# Altium schematic sheet USB_HUB.SchDoc: MISKO 3.0
size A4; Date: 19.9.2021; Author: AMADEJ PAPEŽ; SheetNumber: 4; SheetTotal: 13; SheetTitle: USB_HUB; Version: V1.1
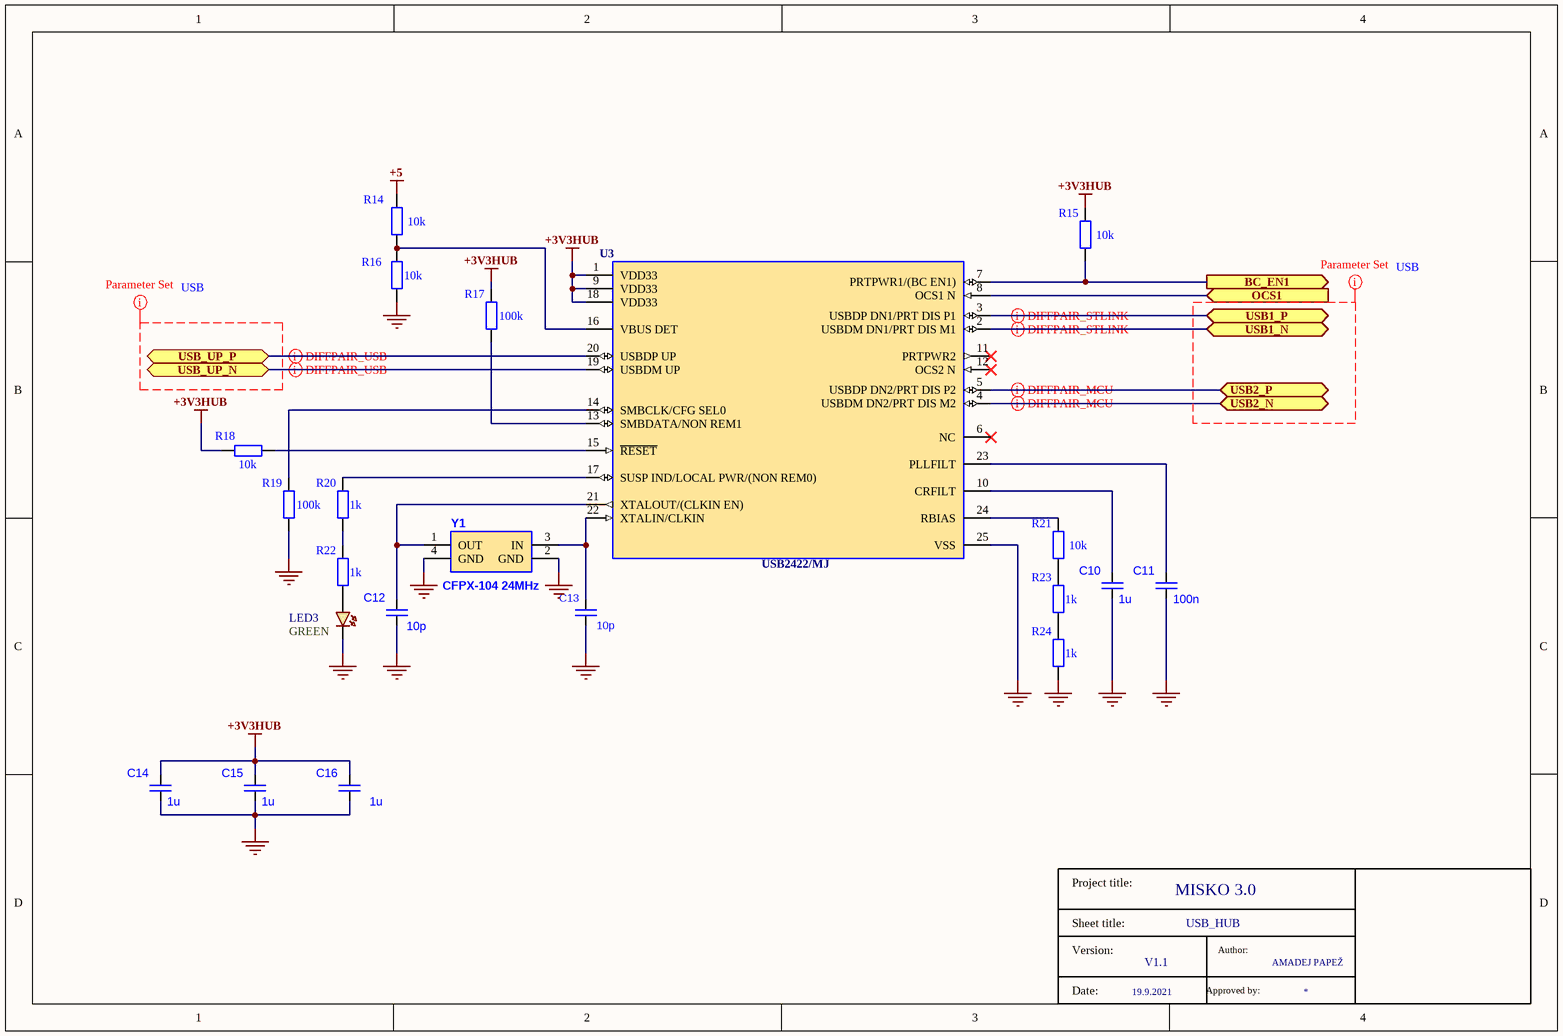
[diagram p0: USB_HUB.SchDoc]

## Parts
C10  value 1u  [C0603]
C11  value 100n  [C0603]
C12  value 10p  [C0603]
C13  value 10p  [C0603]
C14  value 1u  [C0603]
C15  value 1u  [C0603]
C16  value 1u  [C0603]
LED3  GREEN  [LED0603]
R14  value 10k  [R1608_0603I_L]
R15  value 10k  [R1608_0603I_L]
R16  value 10k  [R1608_0603I_L]
R17  value 100k  [R1608_0603I_L]
R18  value 10k  [R1608_0603I_L]
R19  value 100k  [R1608_0603I_L]
R20  value 1k  [R1608_0603I_L]
R21  value 10k  [R1608_0603I_L]
R22  value 1k  [R1608_0603I_L]
R23  value 1k  [R1608_0603I_L]
R24  value 1k  [R1608_0603I_L]
T4  (no value)
U3  USB2422/MJ  [FP-24-S4QFN-4x4B-0_5P-IPC_C]
Y1  CFPX-104 24MHz  [ABM3B24MHZB2T]

## Ports
BC_EN1 (out), OCS1 (in), USB1_N (bidir), USB1_P (bidir), USB2_N (bidir), USB2_P (bidir), USB_UP_N (bidir), USB_UP_P (bidir)

## Nets
+3V3HUB: C14.2 C15.2 C16.2 R15.2 R17.1 R18.2 U3.1(VDD33) U3.9(VDD33) U3.18(VDD33)
+5: R14.2
GND: C10.2 C11.2 C12.1 C13.1 C14.1 C15.1 C16.1 LED3.1(KATODE) R16.1 R19.1 R24.1 U3.25(VSS) Y1.2(GND) Y1.4(GND)
BC_EN1: R15.1 U3.7(PRTPWR1/(BC_EN1)) ; port BC_EN1
OCS1: U3.8(OCS1_N) ; port OCS1
USB1_N: U3.2(USBDM_DN1/PRT_DIS_M1) ; port USB1_N
USB1_P: U3.3(USBDP_DN1/PRT_DIS_P1) ; port USB1_P
USB2_N: U3.4(USBDM_DN2/PRT_DIS_M2) ; port USB2_N
USB2_P: U3.5(USBDP_DN2/PRT_DIS_P2) ; port USB2_P
USB_UP_N: U3.19(USBDM_UP) ; port USB_UP_N
USB_UP_P: U3.20(USBDP_UP) ; port USB_UP_P
NetC10_1: C10.1 U3.10(CRFILT)
NetC11_1: C11.1 U3.23(PLLFILT)
NetC12_2: C12.2 U3.21(XTALOUT/(CLKIN_EN)) Y1.1(OUT)
NetC13_2: C13.2 U3.22(XTALIN/CLKIN) Y1.3(IN)
NetLED3_2: LED3.2(ANODE) R22.2
NetR14_1: R14.1 R16.2 U3.16(VBUS_DET)
NetR17_2: R17.2 U3.13(SMBDATA/NON_REM1)
NetR18_1: R18.1 U3.15(~{RESET})
NetR19_2: R19.2 U3.14(SMBCLK/CFG_SEL0)
NetR20_1: R20.1 U3.17(SUSP_IND/LOCAL_PWR/(NON_REM0))
NetR20_2: R20.2 R22.1
NetR21_1: R21.1 U3.24(RBIAS)
NetR21_2: R21.2 R23.2
NetR23_1: R23.1 R24.2

Not connected (* = marked no-connect by the designer): U3 6(NC)* 11(PRTPWR2)* 12(OCS2_N)*

## Layout directives
differential pair: USB1_N, USB1_P, USB2_N, USB2_P, USB_UP_N, USB_UP_P
net class USB: (no net found under the mark)

## Notes on the sheet
- (in symbol Title block) Project title:; Sheet title:; Version:; Author:; Date:; Approved by:

## Library data of the parts
C10 C14-C16 = C: Capacitor; Code: NB7-1U-25V
C11 = C: Capacitor; Code: NB6-100N
C12 C13 = C: Capacitor; Code: NB2-10P
LED3 = LED: Green light-emitting diode; Code: KLC-G
R14-R16 R18 R21 = R: Code: LC5-10K
R17 R19 = R: Code: LC6-100K
R20 R22-R24 = R: Code: LC4-1K
T4 = Title block
U3 = USB2422/MJ: IC HUB CTLR USB 2.0 24QFN / DataSheet: / http://ww1.microchip.com/downloads/en/devicedoc/00001726b.pdf; Operating Supply Voltage: 3.3V; Data Rate: 480Mbps; Number of Ports: 2; Interface: I2C; Operating Supply Current: 70mA; Code: FC-USB2422MJ; Case/Package: QFN; Packaging: Bulk; Package Quantity: 490; Lead Free: Lead Free; Min Operating Temperature: 0°C; Number of Pins: 24; RoHS Compliant: Yes; Max Operating Temperature: 70°C
Y1 = ABM3B-24MHZ-B-2-T: ComponentLink1Description: New link; ComponentLink1URL: https://www.we-online.com/catalog/datasheet/830032817.pdf; Supplier 1: Würth elektronik; Supplier part number 1: 830032817